# Altium schematic sheet AD7173adcModule.SchDoc
size 431 x 279 mm; SheetNumber: 4; SheetTotal: 13
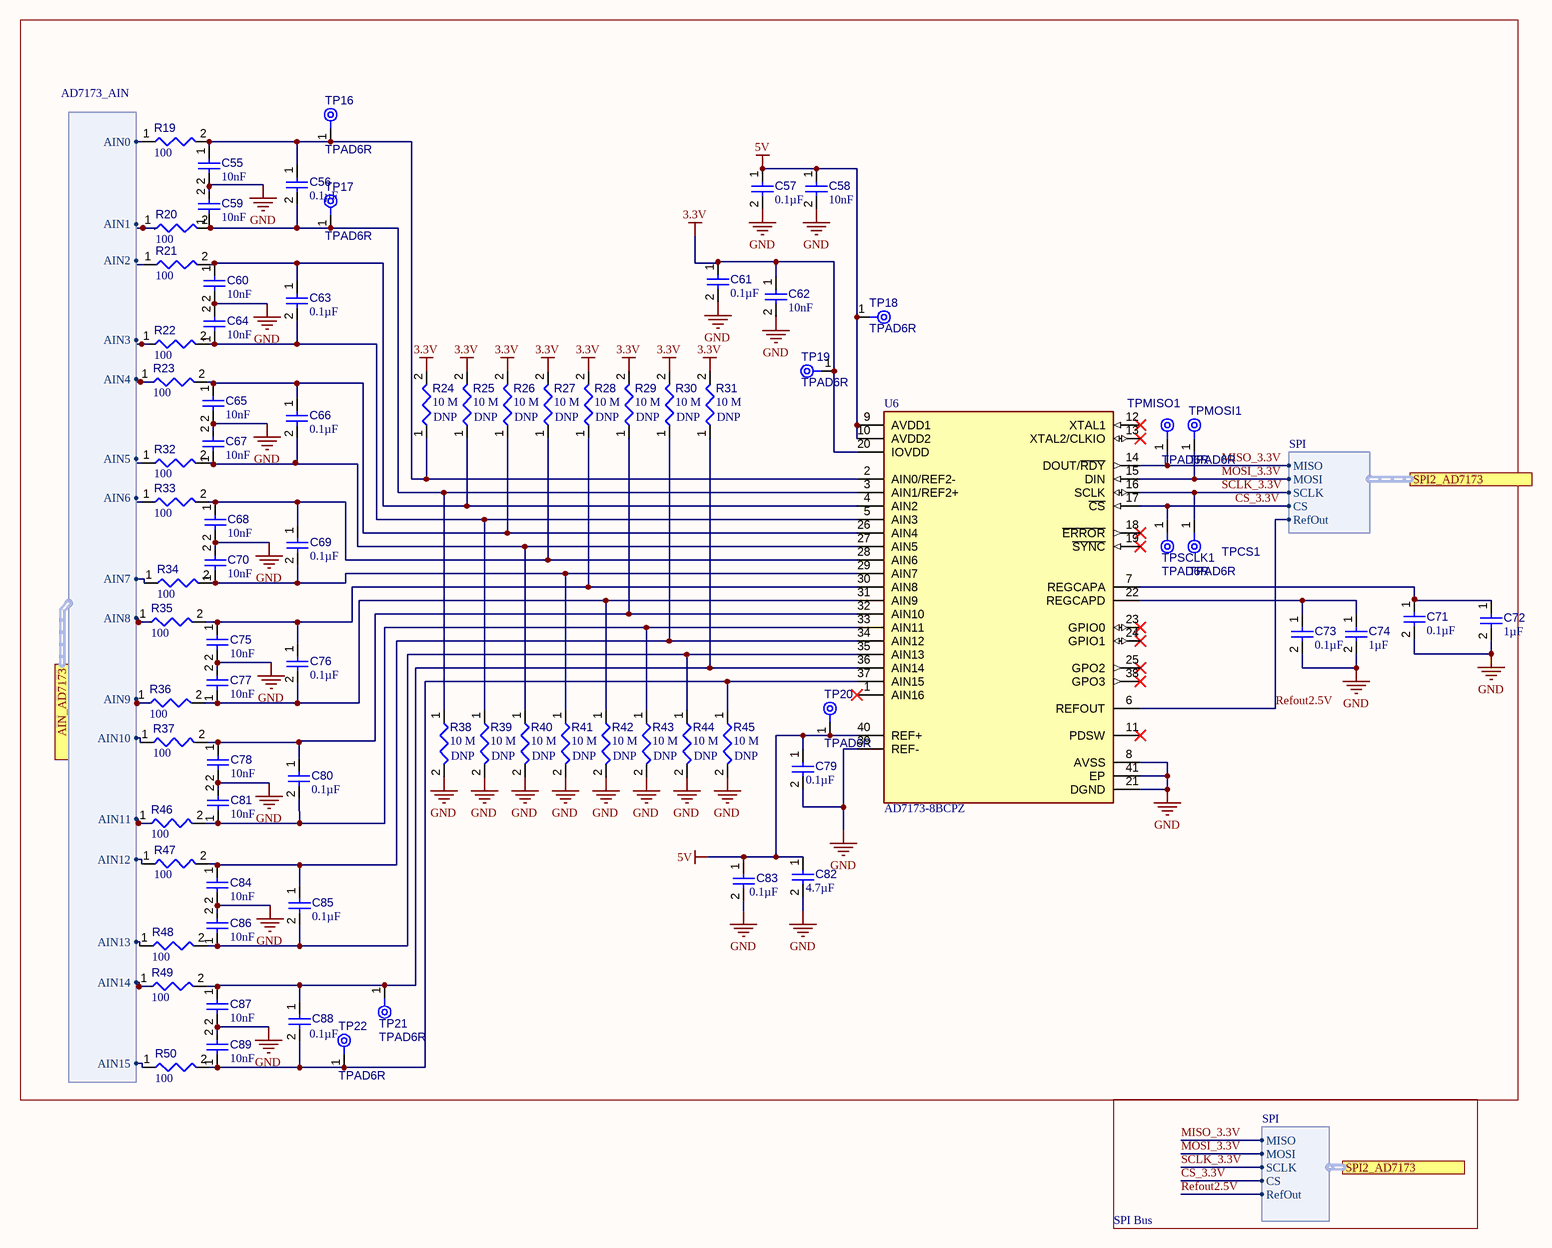
[diagram p0: AD7173adcModule.SchDoc]

## Parts
C55  value 10nF  [CAPC1608X90X40NL10T20]  (hidden comment: Capacitor 100 nF +/-10% 50 V 0603)
C56  value 0.1µF  [CAPC1608X90X40LL10T20]  (hidden comment: Capacitor 1 uF +/- 10% 25 V 0603)
C57  value 0.1µF  [CAPC1608X90X40LL10T20]  (hidden comment: Capacitor 1 uF +/- 10% 25 V 0603)
C58  value 10nF  [CAPC1608X90X40NL10T20]  (hidden comment: Capacitor 100 nF +/-10% 50 V 0603)
C59  value 10nF  [CAPC1608X90X40NL10T20]  (hidden comment: Capacitor 100 nF +/-10% 50 V 0603)
C60  value 10nF  [CAPC1608X90X40NL10T20]  (hidden comment: Capacitor 100 nF +/-10% 50 V 0603)
C61  value 0.1µF  [CAPC1608X90X40LL10T20]  (hidden comment: Capacitor 1 uF +/- 10% 25 V 0603)
C62  value 10nF  [CAPC1608X90X40NL10T20]  (hidden comment: Capacitor 100 nF +/-10% 50 V 0603)
C63  value 0.1µF  [CAPC1608X90X40LL10T20]  (hidden comment: Capacitor 1 uF +/- 10% 25 V 0603)
C64  value 10nF  [CAPC1608X90X40NL10T20]  (hidden comment: Capacitor 100 nF +/-10% 50 V 0603)
C65  value 10nF  [CAPC1608X90X40NL10T20]  (hidden comment: Capacitor 100 nF +/-10% 50 V 0603)
C66  value 0.1µF  [CAPC1608X90X40LL10T20]  (hidden comment: Capacitor 1 uF +/- 10% 25 V 0603)
C67  value 10nF  [CAPC1608X90X40NL10T20]  (hidden comment: Capacitor 100 nF +/-10% 50 V 0603)
C68  value 10nF  [CAPC1608X90X40NL10T20]  (hidden comment: Capacitor 100 nF +/-10% 50 V 0603)
C69  value 0.1µF  [CAPC1608X90X40LL10T20]  (hidden comment: Capacitor 1 uF +/- 10% 25 V 0603)
C70  value 10nF  [CAPC1608X90X40NL10T20]  (hidden comment: Capacitor 100 nF +/-10% 50 V 0603)
C71  value 0.1µF  [CAPC1608X90X40LL10T20]  (hidden comment: Capacitor 1 uF +/- 10% 25 V 0603)
C72  value 1µF  [CAPC1608X94X35NL15T15]  (hidden comment: Capacitor 1 uF +/- 10% 16 V 0603)
C73  value 0.1µF  [CAPC1608X90X40LL10T20]  (hidden comment: Capacitor 1 uF +/- 10% 25 V 0603)
C74  value 1µF  [CAPC1608X94X35NL15T15]  (hidden comment: Capacitor 1 uF +/- 10% 16 V 0603)
C75  value 10nF  [CAPC1608X90X40NL10T20]  (hidden comment: Capacitor 100 nF +/-10% 50 V 0603)
C76  value 0.1µF  [CAPC1608X90X40LL10T20]  (hidden comment: Capacitor 1 uF +/- 10% 25 V 0603)
C77  value 10nF  [CAPC1608X90X40NL10T20]  (hidden comment: Capacitor 100 nF +/-10% 50 V 0603)
C78  value 10nF  [CAPC1608X90X40NL10T20]  (hidden comment: Capacitor 100 nF +/-10% 50 V 0603)
C79  value 0.1µF  [CAPC1608X90X40LL10T20]  (hidden comment: Capacitor 1 uF +/- 10% 25 V 0603)
C80  value 0.1µF  [CAPC1608X90X40LL10T20]  (hidden comment: Capacitor 1 uF +/- 10% 25 V 0603)
C81  value 10nF  [CAPC1608X90X40NL10T20]  (hidden comment: Capacitor 100 nF +/-10% 50 V 0603)
C82  value 4.7µF  [CAPC0603(1608)100_L]  (hidden comment: Capacitor 4.7µF +/-20% 10V 0603)
C83  value 0.1µF  [CAPC1608X90X40LL10T20]  (hidden comment: Capacitor 1 uF +/- 10% 25 V 0603)
C84  value 10nF  [CAPC1608X90X40NL10T20]  (hidden comment: Capacitor 100 nF +/-10% 50 V 0603)
C85  value 0.1µF  [CAPC1608X90X40LL10T20]  (hidden comment: Capacitor 1 uF +/- 10% 25 V 0603)
C86  value 10nF  [CAPC1608X90X40NL10T20]  (hidden comment: Capacitor 100 nF +/-10% 50 V 0603)
C87  value 10nF  [CAPC1608X90X40NL10T20]  (hidden comment: Capacitor 100 nF +/-10% 50 V 0603)
C88  value 0.1µF  [CAPC1608X90X40LL10T20]  (hidden comment: Capacitor 1 uF +/- 10% 25 V 0603)
C89  value 10nF  [CAPC1608X90X40NL10T20]  (hidden comment: Capacitor 100 nF +/-10% 50 V 0603)
R19  value 100  [RESC0603(1608)_L]  (hidden comment: Resistor 120R +/-5 % 0603 0.1 W)
R20  value 100  [RESC0603(1608)_L]  (hidden comment: Resistor 120R +/-5 % 0603 0.1 W)
R21  value 100  [RESC0603(1608)_L]  (hidden comment: Resistor 120R +/-5 % 0603 0.1 W)
R22  value 100  [RESC0603(1608)_L]  (hidden comment: Resistor 120R +/-5 % 0603 0.1 W)
R23  value 100  [RESC0603(1608)_L]  (hidden comment: Resistor 120R +/-5 % 0603 0.1 W)
R24  value 10 M  [RESC0603(1608)_L]  (hidden comment: Resistor 120R +/-5 % 0603 0.1 W)
R25  value 10 M  [RESC0603(1608)_L]  (hidden comment: Resistor 120R +/-5 % 0603 0.1 W)
R26  value 10 M  [RESC0603(1608)_L]  (hidden comment: Resistor 120R +/-5 % 0603 0.1 W)
R27  value 10 M  [RESC0603(1608)_L]  (hidden comment: Resistor 120R +/-5 % 0603 0.1 W)
R28  value 10 M  [RESC0603(1608)_L]  (hidden comment: Resistor 120R +/-5 % 0603 0.1 W)
R29  value 10 M  [RESC0603(1608)_L]  (hidden comment: Resistor 120R +/-5 % 0603 0.1 W)
R30  value 10 M  [RESC0603(1608)_L]  (hidden comment: Resistor 120R +/-5 % 0603 0.1 W)
R31  value 10 M  [RESC0603(1608)_L]  (hidden comment: Resistor 120R +/-5 % 0603 0.1 W)
R32  value 100  [RESC0603(1608)_L]  (hidden comment: Resistor 120R +/-5 % 0603 0.1 W)
R33  value 100  [RESC0603(1608)_L]  (hidden comment: Resistor 120R +/-5 % 0603 0.1 W)
R34  value 100  [RESC0603(1608)_L]  (hidden comment: Resistor 120R +/-5 % 0603 0.1 W)
R35  value 100  [RESC0603(1608)_L]  (hidden comment: Resistor 120R +/-5 % 0603 0.1 W)
R36  value 100  [RESC0603(1608)_L]  (hidden comment: Resistor 120R +/-5 % 0603 0.1 W)
R37  value 100  [RESC0603(1608)_L]  (hidden comment: Resistor 120R +/-5 % 0603 0.1 W)
R38  value 10 M  [RESC0603(1608)_L]  (hidden comment: Resistor 120R +/-5 % 0603 0.1 W)
R39  value 10 M  [RESC0603(1608)_L]  (hidden comment: Resistor 120R +/-5 % 0603 0.1 W)
R40  value 10 M  [RESC0603(1608)_L]  (hidden comment: Resistor 120R +/-5 % 0603 0.1 W)
R41  value 10 M  [RESC0603(1608)_L]  (hidden comment: Resistor 120R +/-5 % 0603 0.1 W)
R42  value 10 M  [RESC0603(1608)_L]  (hidden comment: Resistor 120R +/-5 % 0603 0.1 W)
R43  value 10 M  [RESC0603(1608)_L]  (hidden comment: Resistor 120R +/-5 % 0603 0.1 W)
R44  value 10 M  [RESC0603(1608)_L]  (hidden comment: Resistor 120R +/-5 % 0603 0.1 W)
R45  value 10 M  [RESC0603(1608)_L]  (hidden comment: Resistor 120R +/-5 % 0603 0.1 W)
R46  value 100  [RESC0603(1608)_L]  (hidden comment: Resistor 120R +/-5 % 0603 0.1 W)
R47  value 100  [RESC0603(1608)_L]  (hidden comment: Resistor 120R +/-5 % 0603 0.1 W)
R48  value 100  [RESC0603(1608)_L]  (hidden comment: Resistor 120R +/-5 % 0603 0.1 W)
R49  value 100  [RESC0603(1608)_L]  (hidden comment: Resistor 120R +/-5 % 0603 0.1 W)
R50  value 100  [RESC0603(1608)_L]  (hidden comment: Resistor 120R +/-5 % 0603 0.1 W)
TP16  TPAD6R  [TP06R]  (no BOM)
TP17  TPAD6R  [TP06R]  (no BOM)
TP18  TPAD6R  [TP06R]  (no BOM)
TP19  TPAD6R  [TP06R]  (no BOM)
TP20  TPAD6R  [TP06R]  (no BOM)
TP21  TPAD6R  [TP06R]  (no BOM)
TP22  TPAD6R  [TP06R]  (no BOM)
TPCS1  TPAD6R  [TP06R]  (no BOM)
TPMISO1  TPAD6R  [TP06R]  (no BOM)
TPMOSI1  TPAD6R  [TP06R]  (no BOM)
TPSCLK1  TPAD6R  [TP06R]  (no BOM)
U6  AD7173-8BCPZ  [FP-CP-40-14-IPC_C]

## Ports
AIN_AD7173 (harness AD7173_AIN), SPI2_AD7173 (harness SPI)

## Harnesses
AD7173_AIN: AIN0, AIN1, AIN2, AIN3, AIN4, AIN5, AIN6, AIN7, AIN8, AIN9, AIN10, AIN11, AIN12, AIN13, AIN14, AIN15
SPI: MISO, MOSI, CS, SCLK, RefOut
SPI: MISO, MOSI, SCLK, CS, RefOut

## Nets
3.3V: C61.1 C62.1 R24.2 R25.2 R26.2 R27.2 R28.2 R29.2 R30.2 R31.2 TP19.1(TP) U6.20(IOVDD)
5V: C57.1 C58.1 C79.1 C82.1 C83.1 TP18.1(TP) TP20.1(TP) U6.9(AVDD1) U6.10(AVDD2) U6.40(REF+)
GND: C55.2 C57.2 C58.2 C59.2 C60.2 C61.2 C62.2 C64.2 C65.2 C67.2 C68.2 C70.2 C71.2 C72.2 C73.2 C74.2 C75.2 C77.2 C78.2 C79.2 C81.2 C82.2 C83.2 C84.2 C86.2 C87.2 C89.2 R38.2 R39.2 R40.2 R41.2 R42.2 R43.2 R44.2 R45.2 U6.8(AVSS) U6.21(DGND) U6.39(REF-) U6.41(EP)
CS_3.3V: TPSCLK1.1(TP) U6.17(~{CS}) ; port SPI2_AD7173.CS
MISO_3.3V: TPMISO1.1(TP) U6.14(DOUT/~{RDY}) ; port SPI2_AD7173.MISO
MOSI_3.3V: TPMOSI1.1(TP) U6.15(DIN) ; port SPI2_AD7173.MOSI
Refout2.5V: U6.6(REFOUT) ; port SPI2_AD7173.RefOut
SCLK_3.3V: TPCS1.1(TP) U6.16(SCLK) ; port SPI2_AD7173.SCLK
NetC55_1: C55.1 C56.1 R19.2 R24.1 TP16.1(TP) U6.2(AIN0/REF2-)
NetC56_2: C56.2 C59.1 R20.2 R38.1 TP17.1(TP) U6.3(AIN1/REF2+)
NetC60_1: C60.1 C63.1 R21.2 R25.1 U6.4(AIN2)
NetC63_2: C63.2 C64.1 R22.2 R39.1 U6.5(AIN3)
NetC65_1: C65.1 C66.1 R23.2 R26.1 U6.26(AIN4)
NetC66_2: C66.2 C67.1 R32.2 R40.1 U6.27(AIN5)
NetC68_1: C68.1 C69.1 R27.1 R33.2 U6.28(AIN6)
NetC69_2: C69.2 C70.1 R34.2 R41.1 U6.29(AIN7)
NetC71_1: C71.1 C72.1 U6.7(REGCAPA)
NetC73_1: C73.1 C74.1 U6.22(REGCAPD)
NetC75_1: C75.1 C76.1 R28.1 R35.2 U6.30(AIN8)
NetC76_2: C76.2 C77.1 R36.2 R42.1 U6.31(AIN9)
NetC78_1: C78.1 C80.1 R29.1 R37.2 U6.32(AIN10)
NetC80_2: C80.2 C81.1 R43.1 R46.2 U6.33(AIN11)
NetC84_1: C84.1 C85.1 R30.1 R47.2 U6.34(AIN12)
NetC85_2: C85.2 C86.1 R44.1 R48.2 U6.35(AIN13)
NetC87_1: C87.1 C88.1 R31.1 R49.2 TP21.1(TP) U6.36(AIN14)
NetC88_2: C88.2 C89.1 R45.1 R50.2 TP22.1(TP) U6.37(AIN15)
NetR19_1: R19.1 ; port AIN_AD7173.AIN0
NetR20_1: R20.1 ; port AIN_AD7173.AIN1
NetR21_1: R21.1 ; port AIN_AD7173.AIN2
NetR22_1: R22.1 ; port AIN_AD7173.AIN3
NetR23_1: R23.1 ; port AIN_AD7173.AIN4
NetR32_1: R32.1 ; port AIN_AD7173.AIN5
NetR33_1: R33.1 ; port AIN_AD7173.AIN6
NetR34_1: R34.1 ; port AIN_AD7173.AIN7
NetR35_1: R35.1 ; port AIN_AD7173.AIN8
NetR36_1: R36.1 ; port AIN_AD7173.AIN9
NetR37_1: R37.1 ; port AIN_AD7173.AIN10
NetR46_1: R46.1 ; port AIN_AD7173.AIN11
NetR47_1: R47.1 ; port AIN_AD7173.AIN12
NetR48_1: R48.1 ; port AIN_AD7173.AIN13
NetR49_1: R49.1 ; port AIN_AD7173.AIN14
NetR50_1: R50.1 ; port AIN_AD7173.AIN15

Not connected (* = marked no-connect by the designer): U6 1(AIN16)* 11(PDSW)* 12(XTAL1)* 13(XTAL2/CLKIO)* 18(~{ERROR})* 19(~{SYNC})* 23(GPIO0)* 24(GPIO1)* 25(GPO2)* 38(GPO3)*

## Notes on the sheet
- (near R24) DNP
- (near R25) DNP
- (near R26) DNP
- (near R27) DNP
- (near R28) DNP
- (near R29) DNP
- (near R30) DNP
- (near R31) DNP
- (near R38) DNP
- (near R39) DNP
- (near R40) DNP
- (near R41) DNP
- (near R42) DNP
- (near R43) DNP
- (near R44) DNP
- (near R45) DNP
- SPI Bus
- DWG. NO.
- REV.
- SHT.
- THIS DOCUMENT AND THE DATA DISCLOSED HEREIN OR HEREWITH IS THE PROPERTY OF ALTIUM LIMITED AND MAY BE FREELY DISTRIBUTED IN WHOLE. NO RIGHTS ARE RESERVED OR EXPRESS OR IMPLIED WARANTEE GIVEN.
- REVISION
- DESCRIPTION
- DATE
- APPROVED
- ENG:
- APPROVALS
- PROJECT
- DSN:
- CHK:
- REFERENCE DOCUMENTS
- PROJECT REVISION:
- TITLE
- DOCUMENT REVISION:
- DESIGN ITEM:
- BOM:
- FAB DWG:
- PCB DWG:
- ASSY DWG:
- SCALE:
- SIZE
- B
- CAGE CODE
- FILE NAME
- DWG NO.
- SHEET
- OF
- REV

## Library data of the parts
C55 C58-C60 C62 C64 C65 C67 C68 C70 C75 C77 C78 C81 C84 C86 C87 C89 = CMP-001-00017-6: Chip Capacitor, 100 nF, +/- 10%, 50 V, 0603 (1608 Metric); Voltage Rating: 50V; Capacitor Type: Ceramic; Tolerance: 10%; Mounting Technology: SM; Max Operating Temperature: 125°C; RoHS Compliant: True; Pins: 2; Case/Package: 0603; Min Operating Temperature: -55°C
C56 C57 C61 C63 C66 C69 C71 C73 C76 C79 C80 C83 C85 C88 = CMP-001-00005-6: Chip Capacitor, 1 uF, +/- 10%, 25 V, 0603 (1608 Metric); Capacitor Type: Ceramic; Voltage Rating: 25V; Pins: 2; Mounting Technology: SM; RoHS Compliant: True; Max Operating Temperature: 125°C; Case/Package: 0603; Min Operating Temperature: -55°C; Tolerance: 10%
C72 C74 = CMP-001-00003-6: Chip Capacitor, 1 uF, +/- 10%, 16 V, 0603 (1608 Metric); Voltage Rating: 16V; Capacitor Type: Ceramic; Max Operating Temperature: 125°C; Pins: 2; Tolerance: 10%; Min Operating Temperature: -55°C; RoHS Compliant: True; Mounting Technology: SM; Case/Package: 0603
C82 = CMP-001-00076-4: Chip Capacitor, 4.7µF +/-20%, 10V, 0603, Thickness 1 mm; Tolerance: 10%; Mounting Technology: SMT; Case/Package: 0603; Pins: 2; Min Operating Temperature: -55°C; Max Operating Temperature: 85°C; Voltage Rating: 10V
R19-R50 = CMP-009-00176-3: Chip Resistor, 120 Ohms, +/-5 %, 0.1 W, -55 to 155 degC, 0603; Power: 100mW; Tolerance: 5%; Max Operating Temperature: 155°C; Pins: 2; Case/Package: 0603; Min Operating Temperature: -55°C
TP16-TP22 TPCS1 TPMISO1 TPMOSI1 TPSCLK1 = CMP-00028-00002-2: 0.6mm round; Pins: 1
U6 = CMP-09081-000008-1: IC ADC 24BIT SIGMA-DELTA 40LFCSP; Max Power Dissipation: 28mW; Interface: SPI; Number of A/D Converters: 1; Min Input Voltage: 2.5V; Max Supply Voltage: 5.5V; Min Supply Voltage: 2V; Operating Supply Voltage: 5V; Nominal Supply Current: 2.12mA; Number of Channels: 16; Number of Bits: 24; Output Type: TTL; Power Dissipation: 9.96mW; Sampling Rate: 31.25KS/s; Supply Type: Single; Polarity: Bipolar; Resolution: 24b; Number of Pins: 40; Max Input Voltage: 2.5V; Reference Voltage: 2.5V; Package Quantity: 490; Packaging: Tray; Lead Free: Contains Lead; Min Operating Temperature: -40°C; Mount: Surface Mount; Max Operating Temperature: 105°C; Length: 6.1mm; Contact Plating: Tin; Number of Converters: 1; Case/Package: LFCSP EP; Height: 0.75mm; Width: 6.1mm; Number of Elements: 1; REACH SVHC: No SVHC